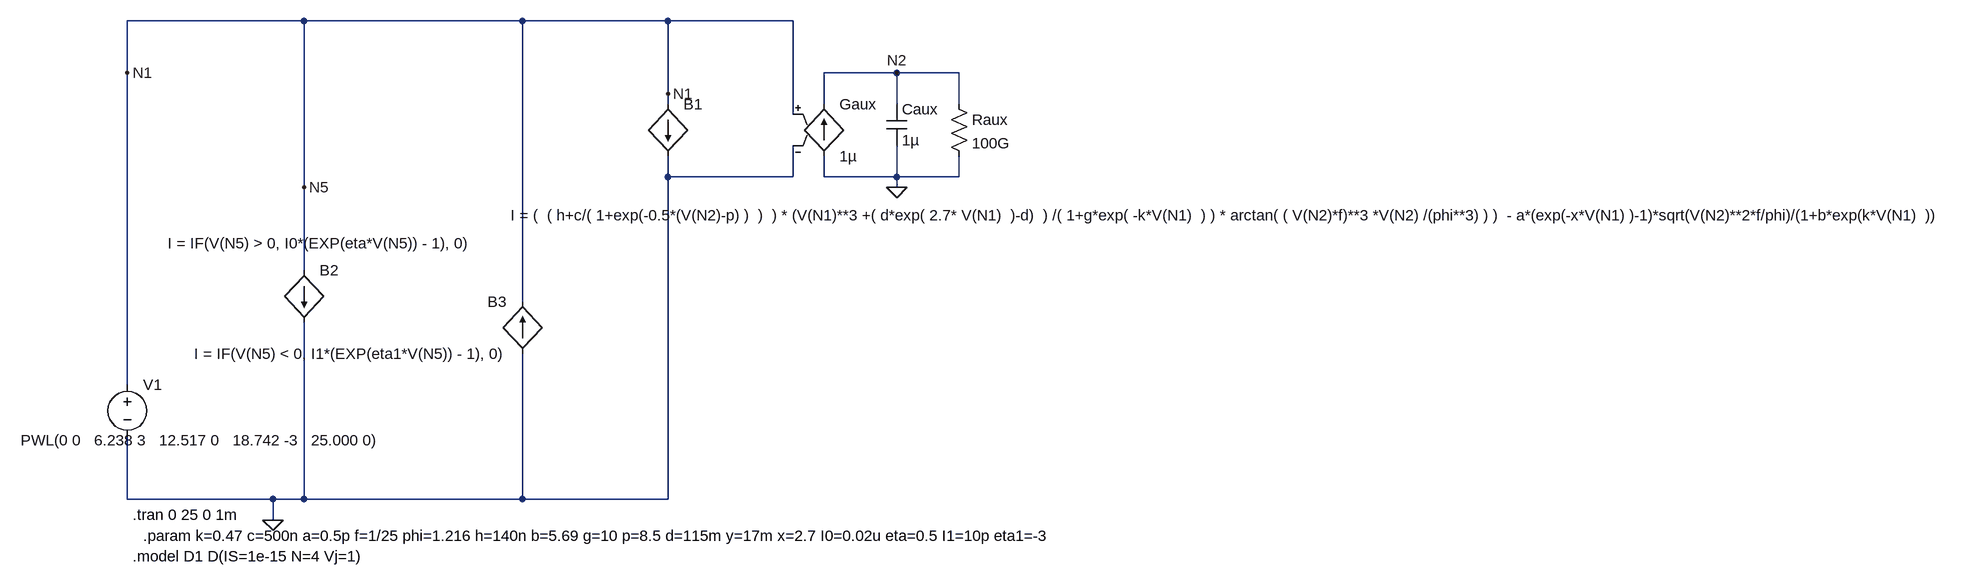
[diagram p0: schematic Modello2k25_modifiable.asc]
Modello2k25_modifiable.asc, the LTspice schematic file:
Version 4
SHEET 1 3392 680
WIRE 32 -240 -240 -240
WIRE 368 -240 32 -240
WIRE 592 -240 368 -240
WIRE 784 -240 592 -240
WIRE -240 -160 -240 -240
WIRE 944 -160 832 -160
WIRE 1040 -160 944 -160
WIRE 592 -128 592 -240
WIRE 592 -112 592 -128
WIRE 832 -112 832 -160
WIRE 944 -112 944 -160
WIRE 1040 -112 1040 -160
WIRE 784 -96 784 -240
WIRE 592 0 592 -32
WIRE 784 0 784 -48
WIRE 784 0 592 0
WIRE 832 0 832 -32
WIRE 944 0 944 -48
WIRE 944 0 832 0
WIRE 1040 0 1040 -32
WIRE 1040 0 944 0
WIRE 32 16 32 -240
WIRE 944 16 944 0
WIRE 32 144 32 16
WIRE 368 192 368 -240
WIRE -240 320 -240 -160
WIRE -240 496 -240 400
WIRE -16 496 -240 496
WIRE 32 496 32 224
WIRE 32 496 -16 496
WIRE 368 496 368 272
WIRE 368 496 32 496
WIRE 592 496 592 0
WIRE 592 496 368 496
WIRE -16 528 -16 496
FLAG 592 -128 N1
FLAG 944 -160 N2
FLAG -16 528 0
FLAG 944 16 0
FLAG 32 16 N5
FLAG -240 -160 N1
SYMBOL voltage -240 304 R0
WINDOW 123 0 0 Left 0
WINDOW 39 0 0 Left 0
WINDOW 3 -164 101 Left 2
SYMATTR Value PWL(0 0   6.238 3   12.517 0   18.742 -3   25.000 0)
SYMATTR InstName V1
SYMBOL bi 592 -112 R0
WINDOW 3 -242 171 Left 2
SYMATTR Value I = (  ( h+c/( 1+exp(-0.5*(V(N2)-p) )  )  ) * (V(N1)**3 +( d*exp( 2.7* V(N1)  )-d)  ) /( 1+g*exp( -k*V(N1)  ) ) * arctan( ( V(N2)*f)**3 *V(N2) /(phi**3) ) )  - a*(exp(-x*V(N1) )-1)*sqrt(V(N2)**2*f/phi)/(1+b*exp(k*V(N1)  ))
SYMATTR InstName B1
SYMBOL g 832 -128 R0
SYMATTR InstName Gaux
SYMATTR Value 1µ
SYMBOL cap 928 -112 R0
SYMATTR InstName Caux
SYMATTR Value 1µ
SYMBOL res 1024 -128 R0
SYMATTR InstName Raux
SYMATTR Value 100G
SYMBOL bi 32 144 R0
WINDOW 3 -210 -42 Left 2
SYMATTR Value I = IF(V(N5) > 0, I0*(EXP(eta*V(N5)) - 1), 0)
SYMATTR InstName B2
SYMBOL bi 368 272 R180
WINDOW 3 24 0 Left 2
WINDOW 0 24 80 Left 2
SYMATTR Value I = IF(V(N5) < 0, I1*(EXP(eta1*V(N5)) - 1), 0)
SYMATTR InstName B3
TEXT -232 520 Left 2 !.tran 0 25 0 1m
TEXT -216 552 Left 2 !.param k=0.47 c=500n a=0.5p f=1/25 phi=1.216 h=140n b=5.69 g=10 p=8.5 d=115m y=17m x=2.7 I0=0.02u eta=0.5 I1=10p eta1=-3
TEXT -232 584 Left 2 !.model D1 D(IS=1e-15 N=4 Vj=1)

The netlist it stands for:
* Modello2k25_modifiable.asc
V1 N5 0 PWL(0 0   6.238 3   12.517 0   18.742 -3   25.000 0)
B1 N5 0 I = (  ( h+c/( 1+exp(-0.5*(V(N2)-p) )  )  ) * (V(N1)**3 +( d*exp( 2.7* V(N1)  )-d)  ) /( 1+g*exp( -k*V(N1)  ) ) * arctan( ( V(N2)*f)**3 *V(N2) /(phi**3) ) )  - a*(exp(-x*V(N1) )-1)*sqrt(V(N2)**2*f/phi)/(1+b*exp(k*V(N1)  ))
Gaux 0 N2 N5 0 1µ
Caux N2 0 1µ
Raux N2 0 100G
B2 N5 0 I = IF(V(N5) > 0, I0*(EXP(eta*V(N5)) - 1), 0)
B3 0 N5 I = IF(V(N5) < 0, I1*(EXP(eta1*V(N5)) - 1), 0)
.tran 0 25 0 1m
.param k=0.47 c=500n a=0.5p f=1/25 phi=1.216 h=140n b=5.69 g=10 p=8.5 d=115m y=17m x=2.7 I0=0.02u eta=0.5 I1=10p eta1=-3
.model D1 D(IS=1e-15 N=4 Vj=1)
.backanno
.end